# EAGLE design MIC_1_0 (EAGLE 8.3.2)
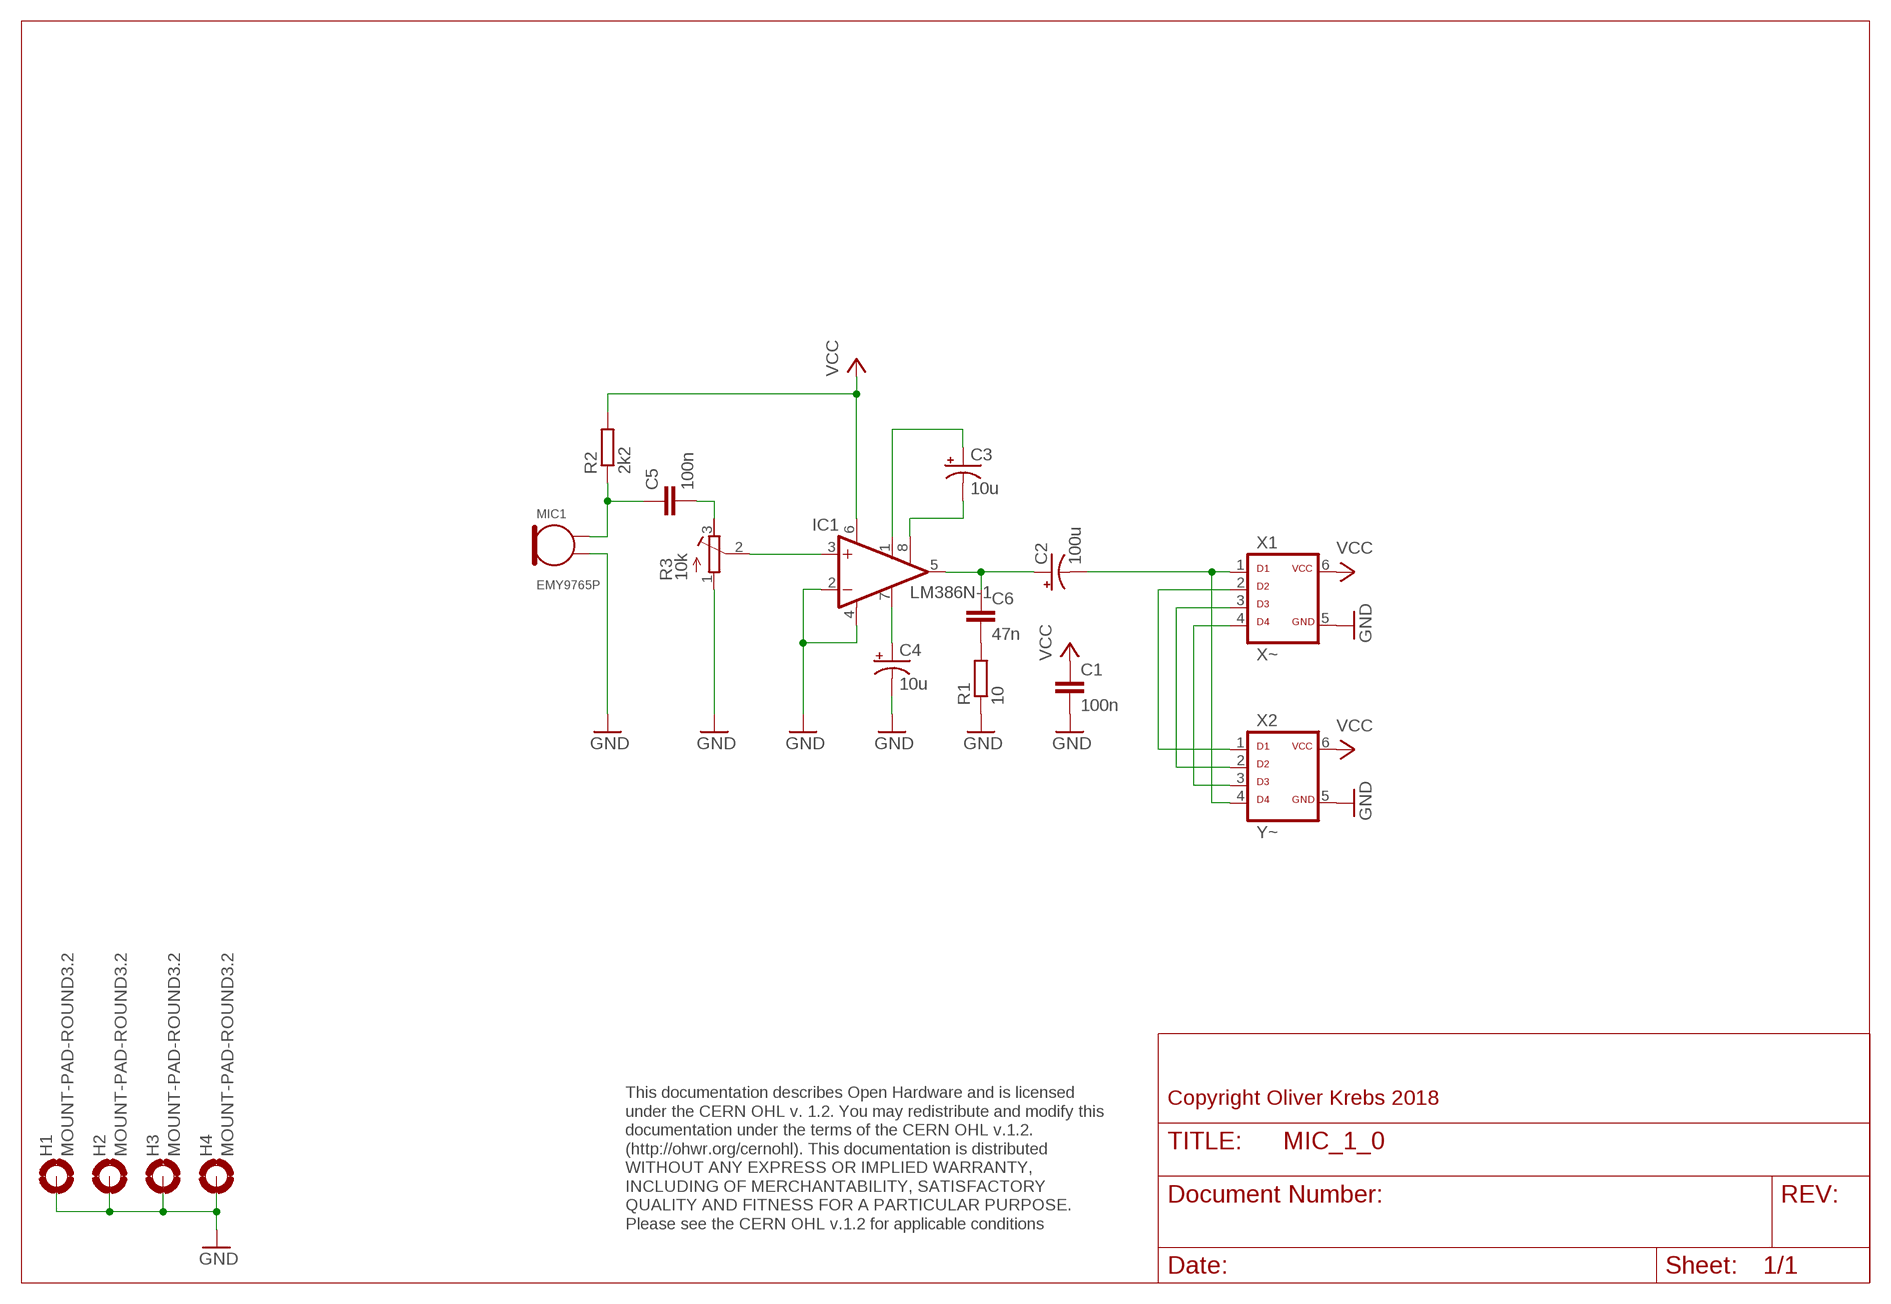
[diagram p0: schematic, sheet 1]

## Parts
C1  100n  C-EU050-025X075  [C050-025X075]
C2  100u  CAP_POLPTH1  [CPOL-RADIAL-100UF-25V]
C3  10u  CAP_POLPTH2  [CPOL-RADIAL-10UF-25V]
C4  10u  CAP_POLPTH2  [CPOL-RADIAL-10UF-25V]
C5  100n  C-EU050-025X075  [C050-025X075]
C6  47n  C-EU050-025X075  [C050-025X075]
H1  MOUNT-PAD-ROUND3.2  [3,2-PAD]
H2  MOUNT-PAD-ROUND3.2  [3,2-PAD]
H3  MOUNT-PAD-ROUND3.2  [3,2-PAD]
H4  MOUNT-PAD-ROUND3.2  [3,2-PAD]
IC1  LM386N-1  [DIL08]
MIC1  EMY9765P  [EMY9765P]
R1  10  R-EU_0207/10  [0207/10]
R2  2k2  R-EU_0207/10  [0207/10]
R3  10k  R-TRIMMACP  [ACP-6L]
X1  X~  ML6D  [ML-6]
X2  Y~  ML6D  [ML-6]

## Nets
GND: C1.2 C4.2(-) H1.B3,2(MOUNT) H2.B3,2(MOUNT) H3.B3,2(MOUNT) H4.B3,2(MOUNT) IC1.2(-IN) IC1.4(GND) MIC1.P$2 R1.1 R3.1(A) X1.5 X2.5
N$1: C3.2(-) IC1.8(GAIN)
N$2: C3.1(+) IC1.1(GAIN)
N$3: C5.2 R3.3(E)
N$4: X1.4 X2.3
N$5: C5.1 MIC1.P$1 R2.1
N$6: IC1.3(+IN) R3.2(S)
N$7: X1.3 X2.2
N$8: C4.1(+) IC1.7(BYPASS)
N$9: C2.1(+) C6.1 IC1.5(OUT)
N$10: C6.2 R1.2
N$11: C2.2(-) X1.1 X2.4
N$12: X1.2 X2.1
VCC: C1.1 IC1.6(VS) R2.2 X1.6 X2.6

## Notes on the sheet
- Copyright Oliver Krebs 2018
- This documentation describes Open Hardware and is licensed 
  under the CERN OHL v. 1.2. You may redistribute and modify this 
  documentation under the terms of the CERN OHL v.1.2. 
  (http://ohwr.org/cernohl). This documentation is distributed
  WITHOUT ANY EXPRESS OR IMPLIED WARRANTY, 
  INCLUDING OF MERCHANTABILITY, SATISFACTORY 
  QUALITY AND FITNESS FOR A PARTICULAR PURPOSE. 
  Please see the CERN OHL v.1.2 for applicable conditions

## Library data of the parts
C1 C5 C6 = 01-my_rcl:C-EU: CAPACITOR, European symbol
C2-C4 = SparkFun-Passives:CAP_POL: Capacitor Polarized These are standard SMD and PTH capacitors. Normally 10uF, 47uF, and 100uF in electrolytic and tantalum varieties. Always verify the external diameter of the through hole cap, it varies with capacity, voltage, and manufacturer. The EIA devices should be standard.
H1-H4 = holes:MOUNT-PAD-ROUND: MOUNTING PAD, round
IC1 = 01-my-linear:LM386?-*: Low Voltage Audio Power Amplifier Source: http://cache.national.com/ds/LM/LM386.pdf
MIC1 = 01-my-con:EMY9765P
R1 R2 = 01-my_rcl:R-EU_: RESISTOR, European symbol
R3 = 01-my_rcl:R-TRIMM: Trimm resistor
X1 X2 = 01-my-con:ML6D

## Board
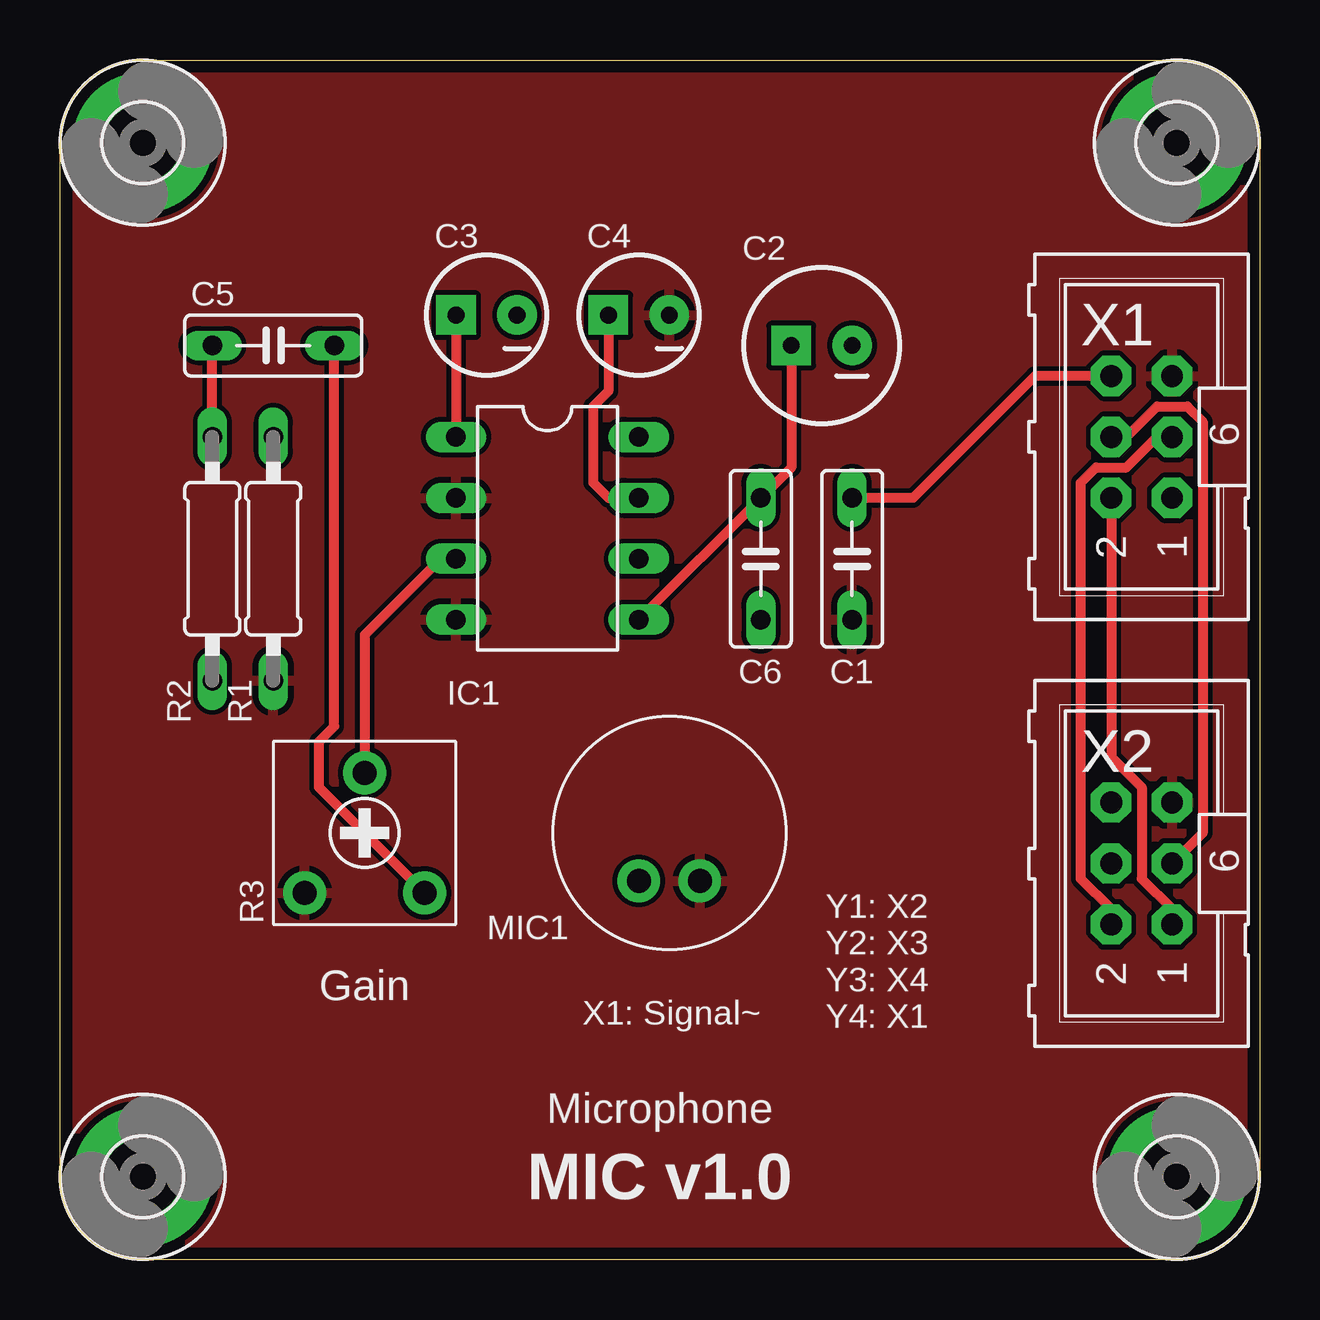
[diagram p1: board, top side]
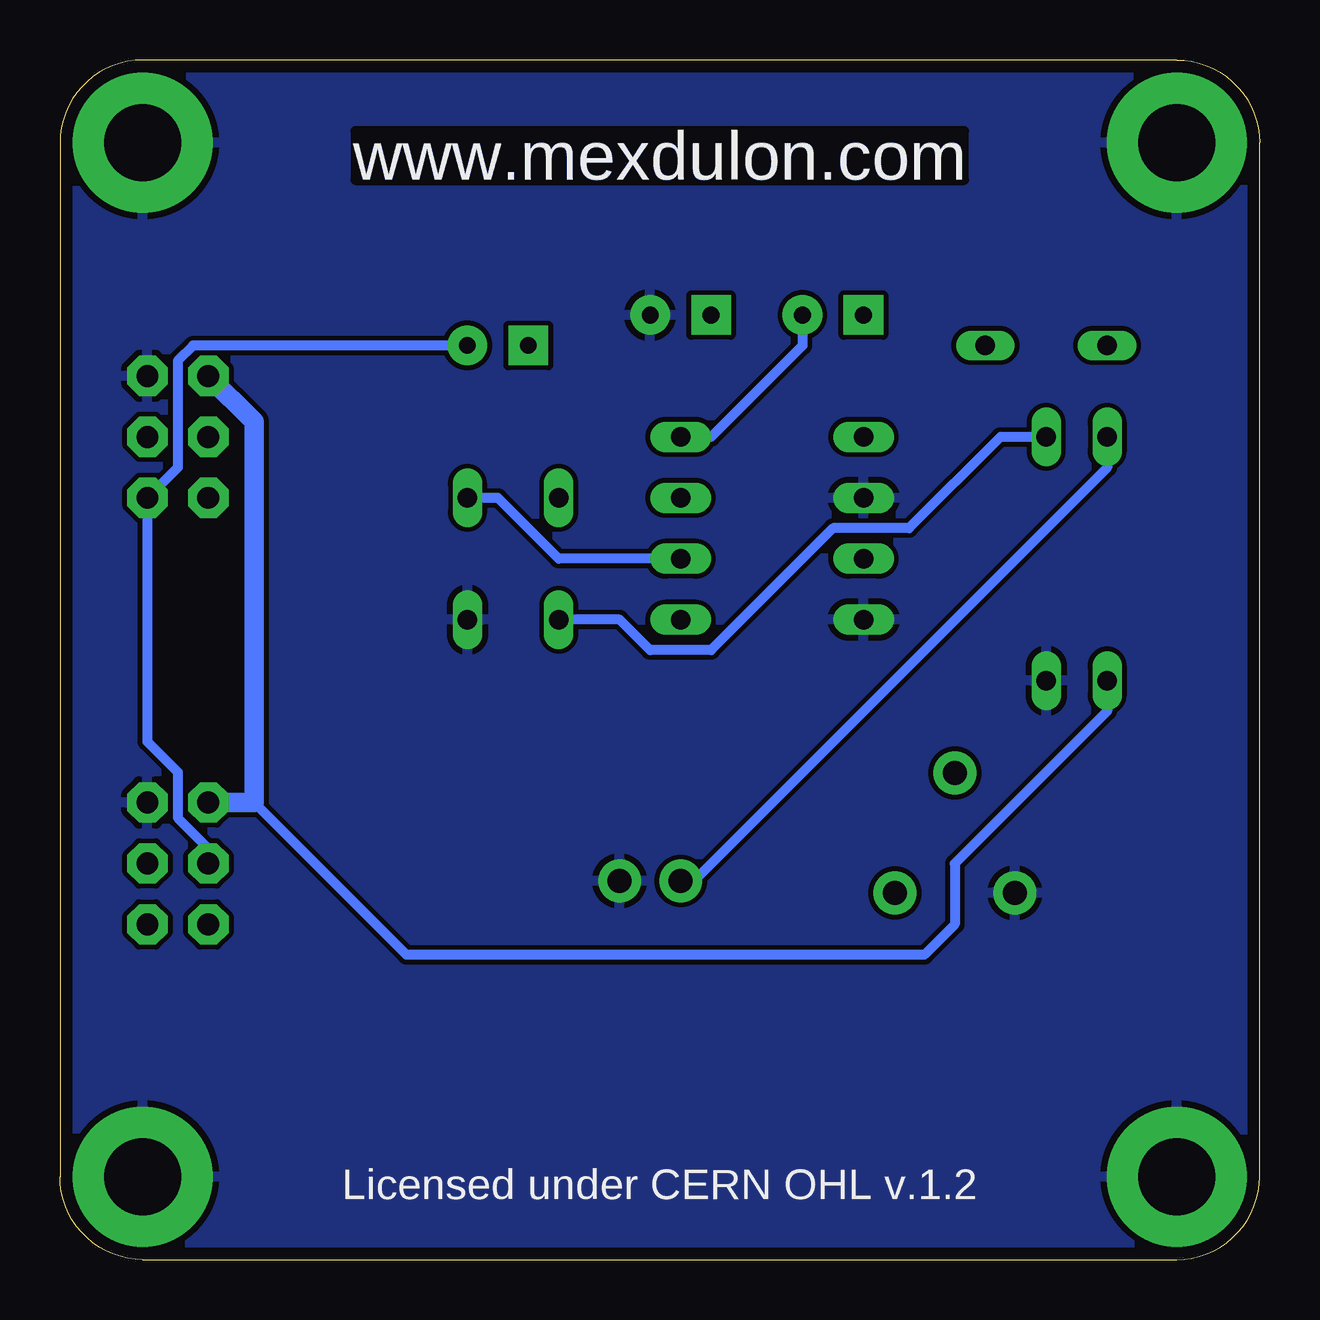
[diagram p2: board, bottom side, seen from below]

Size 50 x 50 mm. Coordinates in mm from the lower left corner, seen from the top.
Outline: 0,3.45 0,46.55 arc-90 3.45,50 46.55,50 arc-90 50,46.55 50,3.45 arc-90 46.55,0 3.45,0 arc-90 0,3.45
Copper layers (1*16): Top 0.035mm / dielectric 1.6mm / Bottom 0.035mm
Design rules "Elecrow_2-layer_PCB_eagle_rule_8mil": minimum track width 8mil, minimum drill 12mil, track to track 8mil, track to pad 8mil, pad to pad 8mil, via to via 8mil, smd to smd 0mil, copper to edge 20mil, drill to drill 10mil, minimum pad ring 6mil, minimum via ring 6mil, stop-mask expansion 0mil, vias tented up to drill 100mil, thermal gap 10mil

### Footprints (pad centres in the part's own frame; a part is rotated, then mirrored left to right if it is on the bottom)
C050-025X075 = drill 0.813 long: 1 -2.54,0; 2 2.54,0
CPOL-RADIAL-100UF-25V = drill 0.7 pad 1.651 square: 1 1.27,0 | drill 0.7 pad 1.651: 2 -1.27,0
CPOL-RADIAL-10UF-25V = drill 0.7 pad 1.651 square: 1 1.27,0 | drill 0.7 pad 1.651: 2 -1.27,0
3,2-PAD = drill 3.2 pad 5.842: B3,2 0,0
DIL08 = drill 0.813 pad 1.27 long: 1 -3.81,-3.81; 2 -1.27,-3.81; 3 1.27,-3.81; 4 3.81,-3.81; 5 3.81,3.81; 6 1.27,3.81; 7 -1.27,3.81; 8 -3.81,3.81
EMY9765P = drill 1 pad 1.778: P$1 -1.27,-2; P$2 1.27,-2
0207/10 = drill 0.813 long: 1 -5.08,0; 2 5.08,0
ACP-6L = drill 1 pad 1.8: 1 -2.5,-2.5; 2 0,2.5; 3 2.5,-2.5
ML-6 = drill 0.914 pad 1.676 octagon: 1 -2.54,-1.27; 2 -2.54,1.27; 3 0,-1.27; 4 0,1.27; 5 2.54,-1.27; 6 2.54,1.27

### Placement (x,y rotation side)
C1  33.02,29.21 270 top
C2  31.75,38.1 180 top
C3  17.78,39.37 180 top
C4  24.13,39.37 180 top
C5  8.89,38.1 0 top
C6  29.21,29.21 270 top
H1  3.45,3.45 0 top
H2  3.45,46.55 0 top
H3  46.55,46.55 0 top
H4  46.55,3.45 0 top
IC1  20.32,30.48 270 top
MIC1  25.4,17.78 0 top
R1  8.89,29.21 90 top
R2  6.35,29.21 270 top
R3  12.7,17.78 0 top
X1  45.09,34.29 90 top
X2  45.09,16.51 90 top

### Tracks (layer width: path | path; a pad name or v marks a point on that pad's centre or on a via)
GND
  pour Bottom (isolate 0.203): 0,50.16 50.8,50.16 50.8,0 0,0
  pour Top (isolate 0.203): 0,50.16 50.8,50.16 50.8,0 0,0
N$1
  Bottom 0.406: C3.2 19.05,38.1 22.86,34.29 IC1.8
N$2
  Top 0.406: C3.1 IC1.1
N$3
  Top 0.406: R3.3 10.79,19.68 10.79,21.59 11.43,22.23 C5.2
N$4
  Top 0.406: X1.4 44.45,34.29 45.72,35.56 46.99,35.56 47.62,34.92 47.62,17.78 X2.3
N$5
  Top 0.406: R2.1 C5.1
  Bottom 0.406: R2.1 6.35,33.02 23.5,15.88 24.04,15.88 MIC1.P$1
N$6
  Top 0.406: IC1.3 15.88,29.21 12.7,26.04 R3.2
N$7
  Top 0.406: X2.2 43.81,14.61 42.55,15.88 42.55,32.38 43.18,33.02 44.45,33.02 45.72,34.29 X1.3
N$8
  Top 0.406: C4.1 22.86,36.2 22.23,35.56 22.23,32.38 22.86,31.75 IC1.7
N$9
  Top 0.406: C2.1 30.48,33.02 C6.1 IC1.5
N$10
  Bottom 0.406: R1.2 10.79,34.29 14.61,30.48 17.78,30.48 22.86,25.4 25.4,25.4 26.67,26.67 C6.2
N$11
  Bottom 0.406: X2.4 43.81,17.14 45.09,18.41 45.09,20.32 46.35,21.59 X1.1 45.09,33.02 45.09,37.47 44.45,38.1 C2.2
N$12
  Top 0.406: X1.2 43.81,20.95 45.09,19.68 45.09,15.88 46.35,14.61 X2.1
VCC
  Top 0.406: X1.6 40.64,36.83 35.56,31.75 C1.1
  Bottom 0.406: R2.2 6.35,22.86 12.7,16.51 12.7,13.97 13.97,12.7 35.56,12.7 41.91,19.05 | IC1.6 29.21,29.21 31.75,31.75 C1.1
  Bottom 0.813: X2.6 41.91,19.05 41.91,34.92 X1.6

### Text on the board
Bottom: www.mexdulon.com
tNames: Y1: X2 / Y2: X3 / Y3: X4 / Y4: X1 | Gain | X1: Signal~ | Microphone | MIC v1.0
bNames: www.mexdulon.com | Licensed under CERN OHL v.1.2
200bmp: E:/Bilder/Elektronik/Modulion/Mexdulon/mexdulon_50x50_pcb.bmp